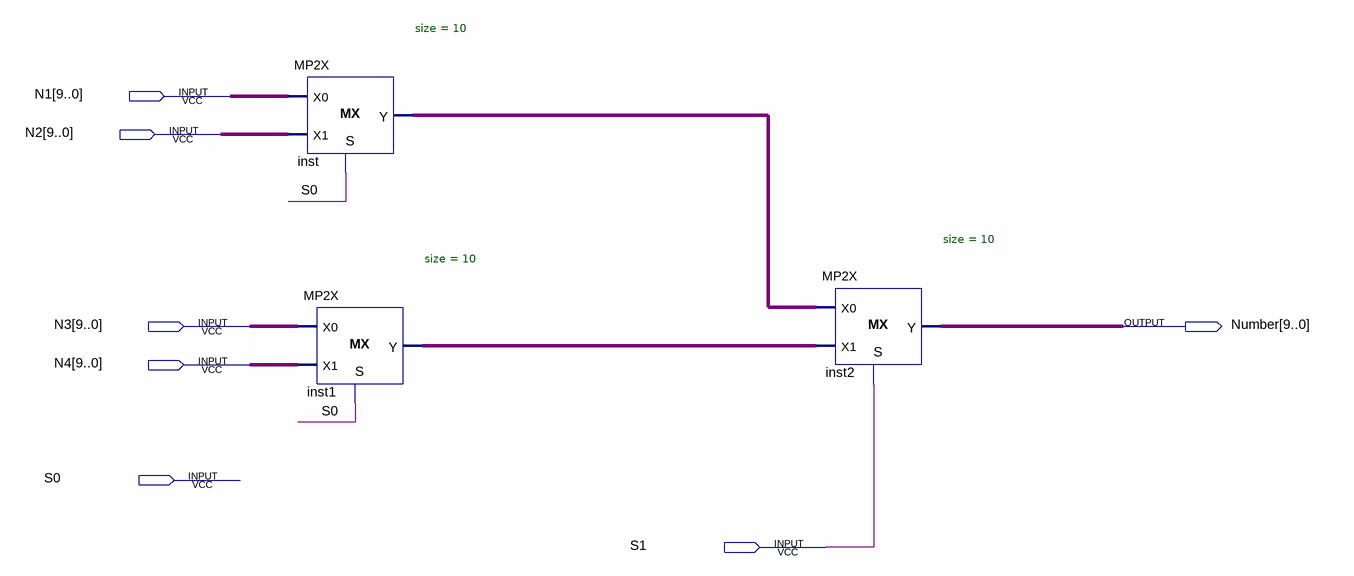
[diagram p0: schematic sheet]
// Quartus schematic MP4X.bdf as structural Verilog: 3 symbols, 7 pins
module MP4X (
  input  [9:0] N1,
  input  [9:0] N2,
  input  [9:0] N3,
  input  [9:0] N4,
  input  S0,
  input  S1,
  output [9:0] Number
);

  wire [9:0] inst1_y, inst_y;

  MP2X #(.size(10)) inst (.S(S0), .X0(N1), .X1(N2), .Y(inst_y));
  MP2X #(.size(10)) inst1 (.S(S0), .X0(N3), .X1(N4), .Y(inst1_y));
  MP2X #(.size(10)) inst2 (.S(S1), .X0(inst_y), .X1(inst1_y), .Y(Number));
endmodule
